# EAGLE design capacitive sensor_V1 (EAGLE 6.1)
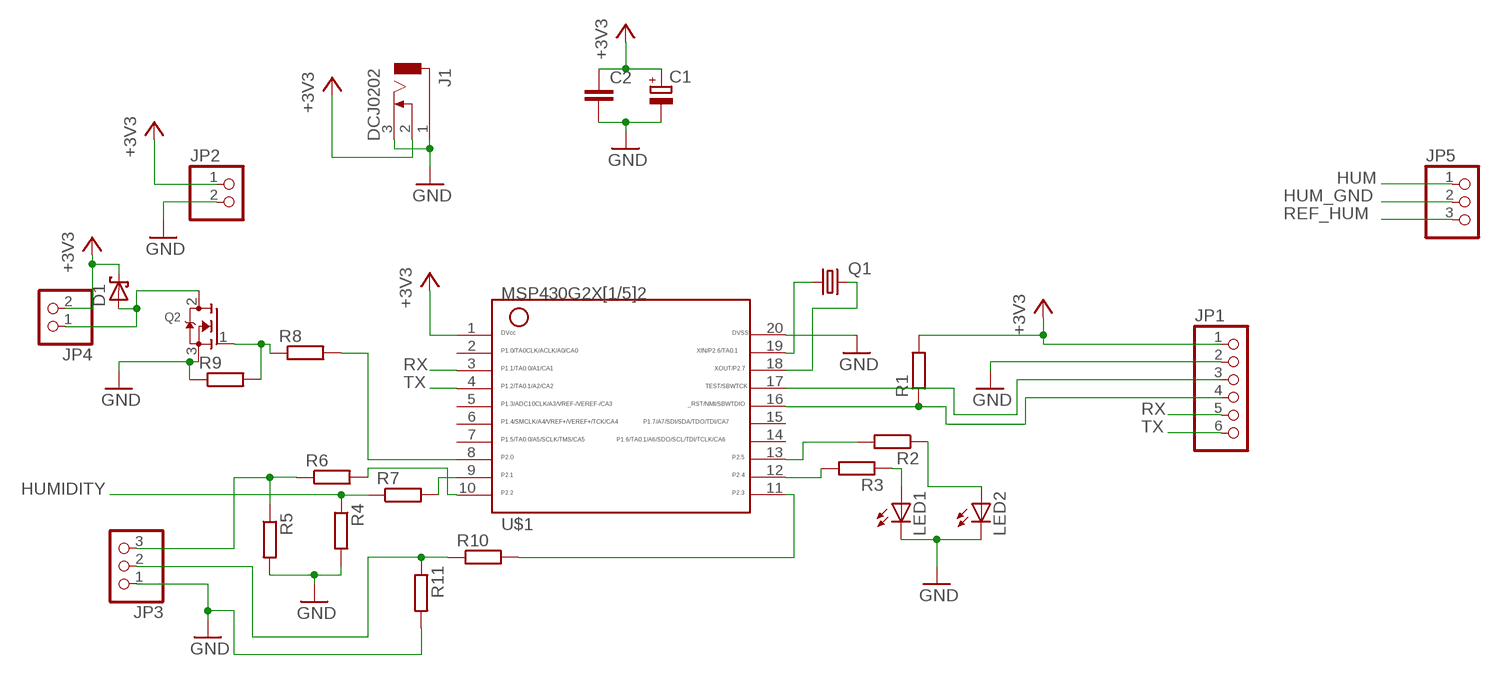
[diagram p0: schematic, sheet 1]

## Parts
C1  CPOL-EUE5-8.5  [E5-8,5]
C2  C-EU025-030X050  [C025-030X050]
D1  SCHOTTKY-DIODEDO41-7  [DO41-7]
J1  DCJ0202  [DCJ0202]
JP1  HEADER-1X6  [1X06_OVAL]
JP2  HEADER-1X2  [1X02_OVAL]
JP3  PINHD-1X3  [1X03]
JP4  HEADER-1X2  [1X02_OVAL]
JP5  PINHD-1X3  [1X03]
LED1  LED3MM  [LED3MM]
LED2  LED3MM  [LED3MM]
Q1  CRYSTALTC26H  [TC26H]
Q2  MOSFET-NGDS_TO220V  [TO220V]
R1  R-EU_0204/7  [0204/7]
R2  R-EU_0204/7  [0204/7]
R3  R-EU_0204/7  [0204/7]
R4  R-EU_0204/7  [0204/7]
R5  R-EU_0204/7  [0204/7]
R6  R-EU_0204/7  [0204/7]
R7  R-EU_0204/7  [0204/7]
R8  R-EU_0204/7  [0204/7]
R9  R-EU_0204/7  [0204/7]
R10  R-EU_0204/7  [0204/7]
R11  R-EU_0204/7  [0204/7]
U$1  G2X[1/5]2---N20  [N20]

## Nets
+3V3: C1.+ C2.1 D1.C J1.2 JP1.1 JP2.1 JP4.2 R1.2 U$1.1
GND: C1.- C2.2 J1.1 J1.3 JP1.2 JP2.2 JP3.1 LED1.K(C) LED2.K(C) Q2.3(S) R4.2 R5.2 R9.1 R11.2 U$1.20
HUM: JP5.1
HUM_GND: JP5.2
HUMIDITY: R4.1 R7.1
N$1: JP1.3 U$1.17
N$2: JP1.4 R1.1 U$1.16
N$3: Q1.1 U$1.19
N$4: LED1.A R3.1
N$5: R3.2 U$1.12
N$6: R2.2 U$1.13
N$7: LED2.A R2.1
N$8: R7.2 U$1.9
N$9: R6.2 U$1.10
N$10: JP3.3 R5.1 R6.1
N$11: Q1.2 U$1.18
N$12: D1.A JP4.1 Q2.2(D)
N$13: Q2.1(G) R8.1 R9.2
N$14: R8.2 U$1.8
N$17: JP3.2 R10.1 R11.1
N$19: R10.2 U$1.11
REF_HUM: JP5.3
RX: JP1.5 U$1.3
TX: JP1.6 U$1.4
Unconnected: U$1.2 U$1.5 U$1.6 U$1.7 U$1.14 U$1.15

## Library data of the parts
C1 = rcl:CPOL-EU: POLARIZED CAPACITOR, European symbol
C2 = rcl:C-EU: CAPACITOR, European symbol
D1 = adafruit:SCHOTTKY-DIODE: Schottky Diode
J1 = con-jack:DCJ0202: DC POWER JACK Source: DCJ0202.pdf; OC_FARNELL: unknown; OC_NEWARK: unknown
JP1 = microbuilder:HEADER-1X6: PIN HEADER
JP2 JP4 = microbuilder:HEADER-1X2: PIN HEADER
JP3 JP5 = pinhead:PINHD-1X3: PIN HEADER
LED1 LED2 = led:LED: LED OSRAM: - CHIPLED LG R971, LG N971, LY N971, LG Q971, LY Q971, LO R971, LY R971 LH N974, LH R974 LS Q976, LO Q976, LY Q976 LO Q996 - Hyper CHIPLED LW Q18S LB Q993, LB Q99A, LB R99A - SideLED LS A670, LO A670, LY A670, LG A670, LP A670 LB A673, LV A673, LT A673, LW A673 LH A674 LY A675 LS A676, LA A676, LO A676, LY A676, LW A676 LS A679, LY A679, LG A679 - Hyper Micro SIDELED® LS Y876, LA Y876, LO Y876, LY Y876 LT Y87S - SmartLED LW L88C, LW L88S LB L89C, LB L89S, LG L890 LS L89K, LO L89K, LY L89K LS L896, LA L896, LO L896, LY L896 - TOPLED LS T670, LO T670, LY T670, LG T670, LP T670 LSG T670, LSP T670, LSY T670, LOP T670, LYG T670 LG T671, LOG T671, LSG T671 LB T673, LV T673, LT T673, LW T673 LH T674 LS T676, LA T676, LO T676, LY T676, LB T676, LH T676, LSB T676, LW T676 LB T67C, LV T67C, LT T67C, LS T67K, LO T67K, LY T67K, LW E67C LS E67B, LA E67B, LO E67B, LY E67B, LB E67C, LV E67C, LT E67C LW T67C LS T679, LY T679, LG T679 LS T770, LO T770, LY T770, LG T770, LP T770 LB T773, LV T773, LT T773, LW T773 LH T774 LS E675, LA E675, LY E675, LS T675 LS T776, LA T776, LO T776, LY T776, LB T776 LHGB T686 LT T68C, LB T68C - Hyper Mini TOPLED® LB M676 - Mini TOPLED Santana® LG M470 LS M47K, LO M47K, LY M47K Source: http://www.osram.convergy.de LUXEON: - LUMILED® LXK2-PW12-R00, LXK2-PW12-S00, LXK2-PW14-U00, LXK2-PW14-V00 LXK2-PM12-R00, LXK2-PM12-S00, LXK2-PM14-U00 LXK2-PE12-Q00, LXK2-PE12-R00, LXK2-PE12-S00, LXK2-PE14-T00, LXK2-PE14-U00 LXK2-PB12-K00, LXK2-PB12-L00, LXK2-PB12-M00, LXK2-PB14-N00, LXK2-PB14-P00, LXK2-PB14-Q00 LXK2-PR12-L00, LXK2-PR12-M00, LXK2-PR14-Q00, LXK2-PR14-R00 LXK2-PD12-Q00, LXK2-PD12-R00, LXK2-PD12-S00 LXK2-PH12-R00, LXK2-PH12-S00 LXK2-PL12-P00, LXK2-PL12-Q00, LXK2-PL12-R00 Source: www.luxeon.com KINGBRIGHT: KA-3528ASYC Source: www.kingbright.com
Q1 = crystal:CRYSTAL: CRYSTAL; OC_FARNELL: unknown; OC_NEWARK: unknown
Q2 = adafruit:MOSFET-N: N-Channel Mosfet 2N7002E - 60V 260mA SOT23 [Digikey: 2N7002ET1GOSTR-ND] - REEL BSH103 - 30V 850mA SOT23 [Digikey: 568-5013-1-ND]
R1-R11 = rcl:R-EU_: RESISTOR, European symbol
U$1 = TI_MSP430_v16:G2X[1/5]2---N20: MSP430G2X[1/5]2 MSP430G2x52, MSP430G2x12 PDIP (N) 20 Pin Package http://focus.ti.com/docs/prod/folders/print/msp430g2452.html

## Board
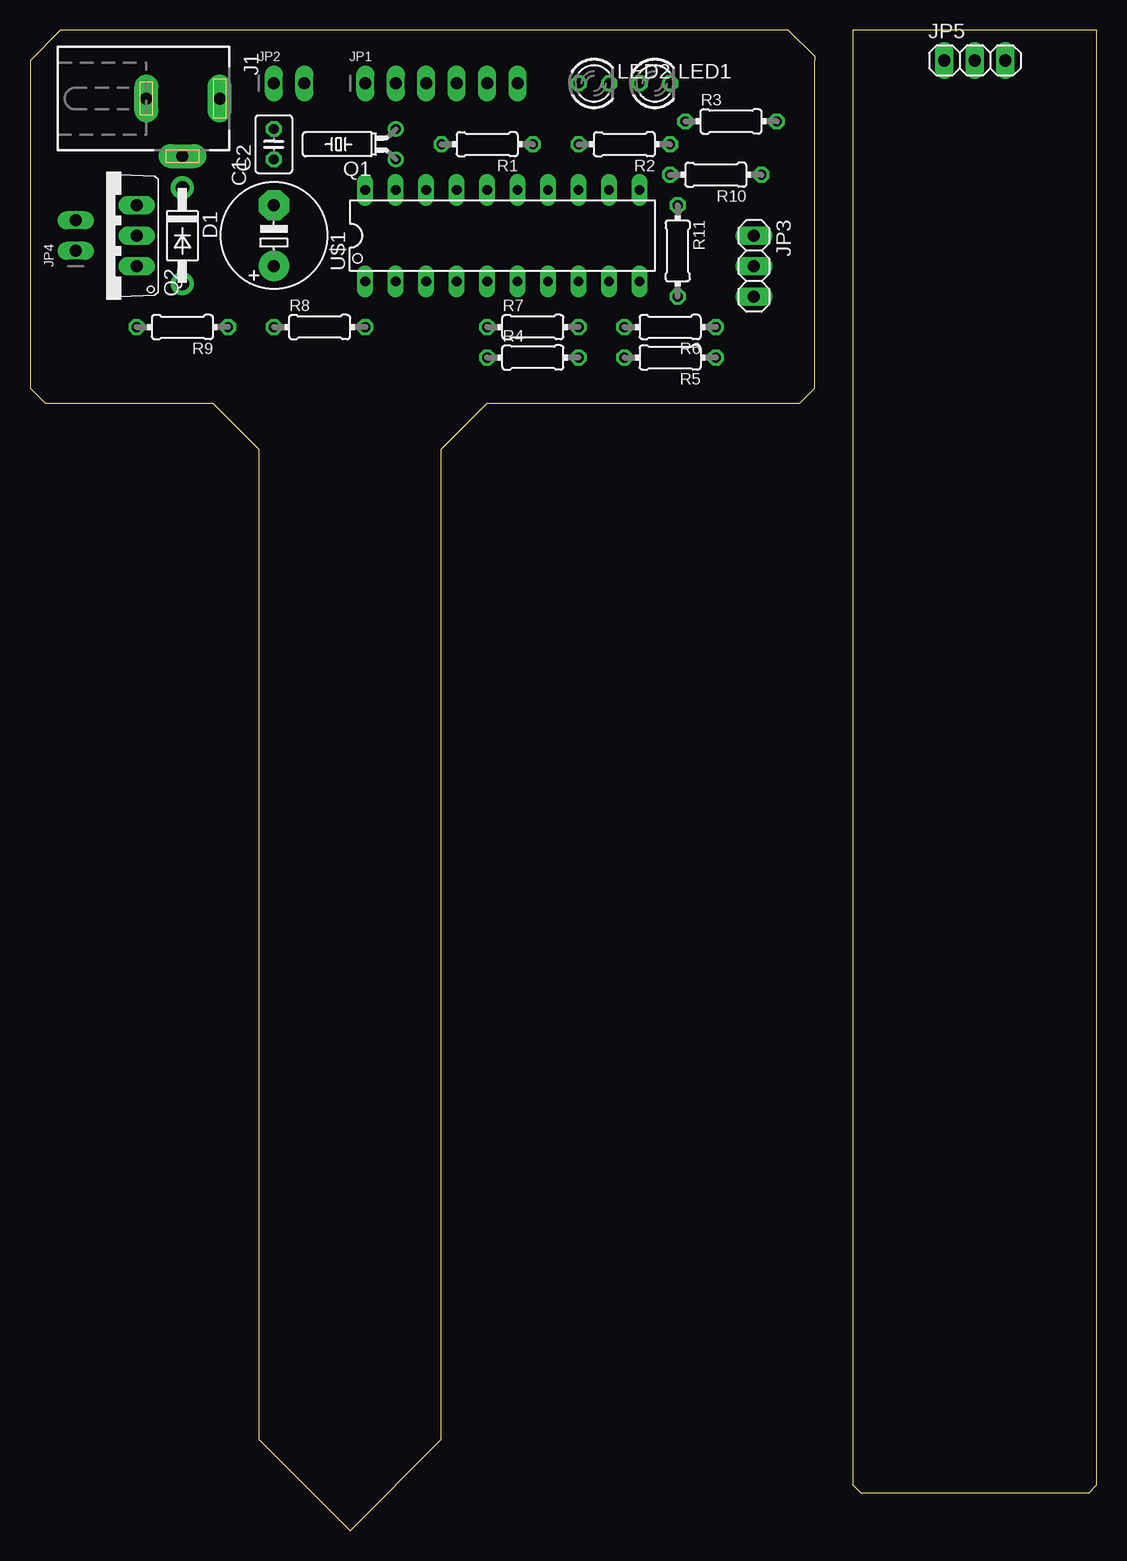
[diagram p1: board, top side]
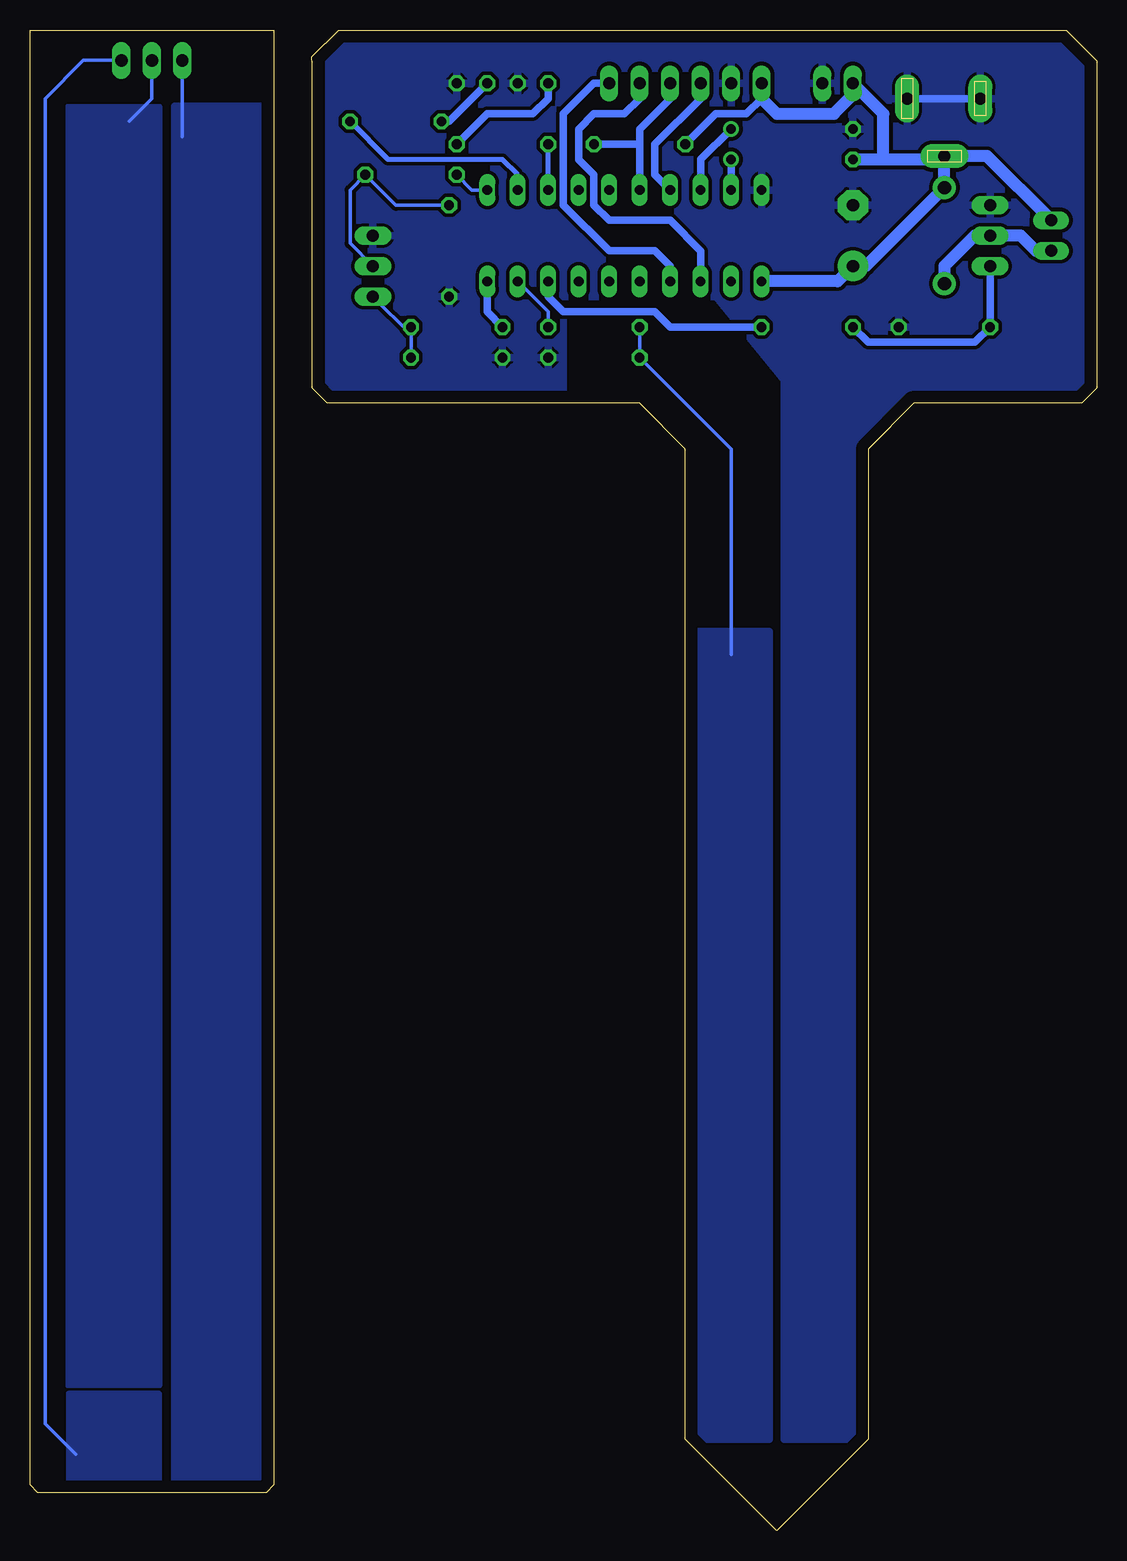
[diagram p2: board, bottom side, seen from below]

Size 88.9 x 125.09 mm. Coordinates in mm from the lower left corner, seen from the top.
Outline: 65.38,96.52 65.38,122.22 65.42,122.86 63.18,125.09 10.16,125.09 2.53,125.08 0,122.54 0,95.25 1.27,93.98 15.24,93.98 19.05,90.17 19.05,7.62 26.67,0 34.29,7.62 34.29,90.17 38.1,93.98 64.13,93.98 65.38,95.23 65.38,97.79
Outline: 68.58,125.09 68.58,3.81 69.21,3.17 88.27,3.17 88.9,3.81 88.9,125.09 68.58,125.09
Copper layers (1*16): Top 0.035mm / dielectric 1.5mm / Bottom 0.035mm
Design rules: minimum track width 10mil, minimum drill 24mil, track to track 8mil, track to pad 8mil, pad to pad 8mil, via to via 8mil, smd to smd 8mil, copper to edge 40mil, drill to drill 8mil, minimum pad ring 10mil, minimum via ring 8mil, stop-mask expansion 4mil, vias tented up to drill 0mil, thermal gap 10mil

### Footprints (pad centres in the part's own frame; a part is rotated, then mirrored left to right if it is on the bottom)
E5-8,5 = drill 1.016 pad 2.54: + -2.54,0 | drill 1.016 pad 2.54 octagon: - 2.54,0
C025-030X050 = drill 0.813 octagon: 1 -1.27,0; 2 1.27,0
DO41-7 = drill 1.118 pad 1.93: A 4,0; C -4,0
DCJ0202 = drill 1 pad 2 long: 1 0,3.1; 2 4.8,0; 3 0,-3
1X06_OVAL = drill 1 long: 1 -6.35,0; 2 -3.81,0; 3 -1.27,0; 4 1.27,0; 5 3.81,0; 6 6.35,0
1X02_OVAL = drill 1 long: 1 -1.27,0; 2 1.27,0
1X03 = drill 1.016 long: 1 -2.54,0; 2 0,0; 3 2.54,0
LED3MM = drill 0.813 octagon: A -1.27,0; K 1.27,0
TC26H = drill 0.813: 1 -1.27,0; 2 1.27,0
TO220V = drill 1.016 long: 1 -2.54,-2.54; 2 0,-2.54; 3 2.54,-2.54
0204/7 = drill 0.813 octagon: 1 -3.81,0; 2 3.81,0
N20 = drill 0.813 long: 1 -11.435,-3.81; 2 -8.895,-3.81; 3 -6.355,-3.81; 4 -3.815,-3.81; 5 -1.275,-3.81; 6 1.265,-3.81; 7 3.805,-3.81; 8 6.345,-3.81; 9 8.885,-3.81; 10 11.425,-3.81; 11 11.425,3.81; 12 8.885,3.81; 13 6.345,3.81; 14 3.805,3.81; 15 1.265,3.81; 16 -1.275,3.81; 17 -3.815,3.81; 18 -6.355,3.81; 19 -8.895,3.81; 20 -11.435,3.81

### Placement (x,y rotation side)
C1  20.32,107.95 90 top
C2  20.32,115.57 90 top
D1  12.7,107.95 270 top
J1  12.7,119.38 270 top
JP1  34.29,120.65 0 top
JP2  21.59,120.65 0 top
JP3  60.33,105.41 270 top
JP4  3.81,107.95 90 top
JP5  78.74,122.56 0 top
LED1  52.07,120.65 0 top
LED2  46.99,120.65 0 top
Q1  30.48,115.57 90 top
Q2  6.35,107.95 90 top
R1  38.1,115.57 180 top
R2  49.53,115.57 180 top
R3  58.42,117.47 0 top
R4  41.91,97.79 0 top
R5  53.34,97.79 180 top
R6  53.34,100.33 180 top
R7  41.91,100.33 0 top
R8  24.13,100.33 0 top
R9  12.7,100.33 180 top
R10  57.15,113.03 180 top
R11  53.98,106.68 270 top
U$1  39.37,107.95 0 top

### Tracks (layer width: path | path; a pad name or v marks a point on that pad's centre or on a via)
+3V3
  Bottom 0.61: J1.2 12.98,114.3 | R1.2 31.75,118.11 29.21,118.11 27.94,119.38
  Bottom 1.016: JP4.2 9.17,114.58 J1.2 D1.C 19.24,105.41 C1.+ 21.59,104.14 U$1.1 | 12.98,114.3 17.78,114.3 | 17.78,114.3 C2.1 | JP1.1 27.94,119.38 26.67,118.11 21.91,118.11 20.32,119.7 JP2.1 17.78,118.11 17.78,114.3
GND
  Bottom 0.61: J1.3 J1.1
  pour Bottom (isolate 0.305): 0.63,125.73 0.63,93.98 15.24,93.98 19.05,90.17 19.05,7.62 26.04,7.62 26.04,95.88 31.75,102.87 44.45,102.87 44.45,93.98 64.13,93.98 64.13,125.73
HUM
  Bottom 0.305: JP5.1 76.2,116.2
  pour Bottom (isolate 0.305): 69.21,118.75 76.83,118.75 76.83,3.81 69.21,3.81
HUM_GND
  Bottom 0.305: JP5.2 78.74,119.38 80.64,117.47
  pour Bottom: 78.1,12.06 85.72,12.06 85.72,118.75 78.1,118.75
HUMIDITY
  Bottom 0.305: R7.1 R4.1 30.48,90.17 30.48,73.03
  pour Bottom: 27.3,7.62 34.29,7.62 34.29,74.93 27.3,74.93
N$1
  Bottom 0.61: U$1.17 36.83,113.03 36.83,115.57 33.02,119.38 JP1.3
N$2
  Bottom 0.61: JP1.4 35.56,119.38 38.1,116.84 38.1,115.57 | 38.1,115.57 R1.1 | U$1.16 38.1,115.57
N$3
  Bottom 0.305: U$1.19
  Bottom 0.61: Q1.1 U$1.19
N$4
  Bottom 0.61: R3.1 53.98,117.47 LED1.A
N$5
  Bottom 0.406: U$1.12 48.26,113.03 49.53,114.3 59.05,114.3 R3.2
N$6
  Bottom 0.305: R2.2
  Bottom 0.406: U$1.13 R2.2
N$7
  Bottom 0.61: R2.1 50.8,118.11 46.99,118.11 45.72,119.38 LED2.A
N$8
  Bottom 0.305: U$1.9 45.72,101.6 R7.2
N$9
  Bottom 0.61: R6.2 50.8,101.59 U$1.10
N$10
  Bottom 0.305: R6.1 57.15,99.69 | 57.15,99.69 R5.1 | 57.15,99.69 JP3.3
N$11
  Bottom 0.61: Q1.2 33.02,114.31 U$1.18
N$12
  Bottom 0.61: 12.7,104.14 D1.A
  Bottom 1.016: JP4.1 5.08,106.68 6.35,107.95 Q2.2 10.16,107.95 12.7,105.41 12.7,104.14
N$13
  Bottom 0.61: R8.1 19.05,99.06 10.16,99.06 R9.2 Q2.1
N$14
  Bottom 0.61: R8.2 35.56,100.33 36.83,101.6 44.45,101.6 45.72,102.87 U$1.8
N$17
  Bottom 0.305: JP3.2 62.23,107.31 62.23,111.76 R10.1 58.42,110.49 R11.1
N$19
  Bottom 0.305: U$1.11 52.07,111.76 R10.2
REF_HUM
  Bottom 0.305: 85.09,6.35 87.63,8.89 87.63,119.38 84.45,122.56 JP5.3
  pour Bottom: 78.1,11.43 85.72,11.43 85.72,3.81 78.1,3.81
RX
  Bottom 0.61: JP1.5 38.1,119.38 39.37,118.11 41.91,118.11 43.18,116.84 43.18,114.3 41.91,113.03 41.91,110.49 40.64,109.22 35.56,109.22 33.02,106.67 U$1.3
TX
  Bottom 0.61: U$1.4 35.55,105.41 36.83,106.68 40.63,106.68 44.45,110.49 44.45,118.11 41.91,120.65 JP1.6